# EAGLE design wiPOWER (EAGLE 9.6.1)
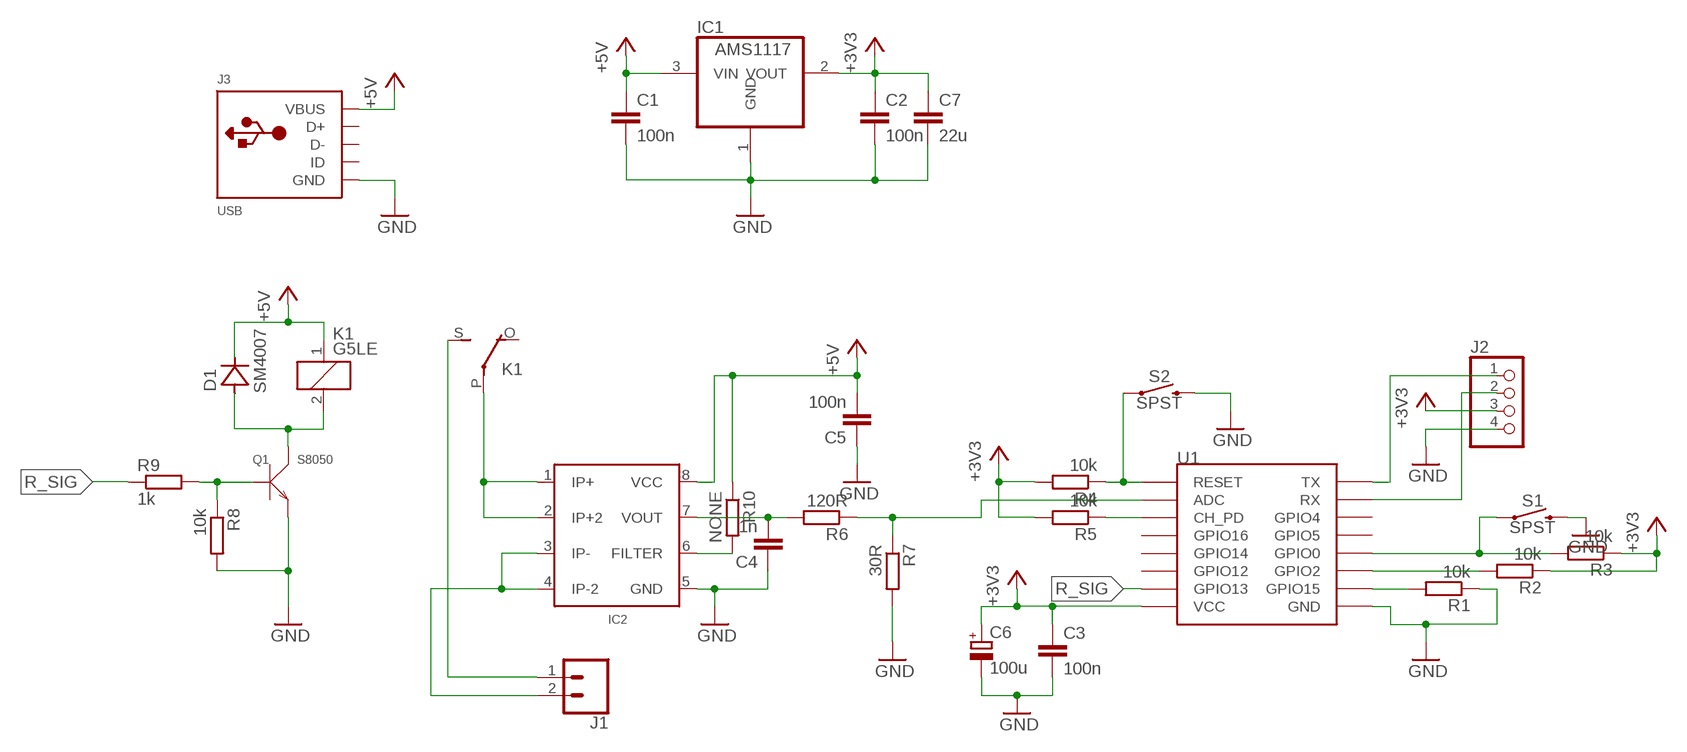
[diagram p0: schematic, sheet 1]

## Parts
C1  100n  C-EUC0603  [C0603]
C2  100n  C-EUC0603  [C0603]
C3  100n  C-EUC0603  [C0603]
C4  1n  C-EUC0603  [C0603]
C5  100n  C-EUC0603  [C0603]
C6  100u  CPOL-EUB/3528-21R  [B/3528-21R]
C7  22u  C-EUC0603  [C0603]
D1  SM4007  SM4007PL  [DIODE_SOD123]
IC1  AMS1117  REG1117  [SOT223]
IC2  ACS712SOIC8  [SOIC8]
J1  CONN_025MM  [SCREWTERMINAL-5MM-2]
J2  PINHD-1X4  [1X04]
J3  USB  USB-MICRO  [MIC-USB]
K1  G5LE  [G5LE]
Q1  S8050  SMD-TRANSISTORS-NPN-25V-500MW-S8050(SOT-23)  [SOT-23]
R1  10k  R-EU_R0603  [R0603]
R2  10k  R-EU_R0603  [R0603]
R3  10k  R-EU_R0603  [R0603]
R4  10k  R-EU_R0603  [R0603]
R5  10k  R-EU_R0603  [R0603]
R6  120R  R-EU_R0603  [R0603]
R7  30R  R-EU_R0603  [R0603]
R8  10k  R-EU_R0603  [R0603]
R9  1k  R-EU_R0603  [R0603]
R10  NONE  R-EU_R0603  [R0603]
S1  SPST  MOMENTARY-SWITCH-SPST-SMD-6.0X3.5MM  [TACTILE_SWITCH_SMD_6.0X3.5MM]
S2  SPST  MOMENTARY-SWITCH-SPST-SMD-6.0X3.5MM  [TACTILE_SWITCH_SMD_6.0X3.5MM]
U1  ESP12SMD  [ESP12-SMD]

## Nets
+3V3 [power]: C2.1 C3.1 C6.+ C7.1 IC1.2(VOUT) J2.3 R2.1 R3.1 R4.2 R5.2 U1.VCC
+5V: C1.1 C5.2 D1.C IC1.3(VIN) IC2.8(VCC) J3.P$5(VBUS) K1.1 R10.1
GND [power]: C1.2 C2.2 C3.2 C4.1 C5.1 C6.- C7.2 IC1.1(GND) IC2.5(GND) J2.4 J3.P$2(GND) Q1.2(E) R1.1 R7.2 R8.2 S1.2 S2.2 U1.GND
IP+ [high]: IC2.1(IP+) IC2.2(IP+2) K1.P(2:P)
IP- [high]: IC2.3(IP-) IC2.4(IP-2) J1.2
N$1: J2.1 U1.TXD0(TX)
N$2: J2.2 U1.RXD0(RX)
N$3: IC2.6(FILTER) R10.2
N$4: R4.1 S2.1 U1.RESET
N$5 [sig]: C4.2 IC2.7(VOUT) R6.2
N$6 [sig]: R6.1 R7.1 U1.ADC
N$7: R5.1 U1.CH_PD
N$10: R1.2 U1.GPIO15
N$11: R2.2 U1.GPIO2
N$12: R3.2 S1.1 U1.GPIO0
N$14: D1.A K1.2 Q1.3(C)
N$15: Q1.1(B) R8.1 R9.2
PRE_IP+ [high]: J1.1 K1.S(2:S)
R_SIG: R9.1 U1.GPIO13
Unconnected: J3.P$1(ID) J3.P$3(D+) J3.P$4(D-) K1.O(2:O) U1.GPIO4 U1.GPIO5 U1.GPIO12 U1.GPIO14 U1.GPIO16

## Library data of the parts
C1-C5 C7 = rcl:C-EU: CAPACITOR, European symbol; SPICEPREFIX: C
C6 = rcl:CPOL-EU: POLARIZED CAPACITOR, European symbol; SPICEPREFIX: C
D1 = mylib:SM4007PL
IC1 = burr-brown:REG1117: 800mA and 1A Low Dropout (LDO) Positive Regulator 1.8V, 2.5V, 2.85V, 3.3V, 5V, and Adj; MPN: REG1117; OC_FARNELL: 1097566; OC_NEWARK: 14P6981
IC2 = mylib:ACS712
J1 = SparkFun-Connectors:CONN_02: Multi connection point. Often used as Generic Header-pin footprint for 0.1 inch spaced/style header connections On any of the 0.1 inch spaced packages, you can populate with these: Break Away Headers - Straight <https://www.sparkfun.com/products/116> (PRT-00116) Break Away Male Headers - Right Angle <https://www.sparkfun.com/products/553> (PRT-00553) Female Headers <https://www.sparkfun.com/products/115> (PRT-00115) Break Away Headers - Machine Pin <https://www.sparkfun.com/products/117> (PRT-00117) Break Away Female Headers - Swiss Machine Pin <https://www.sparkfun.com/products/743> (PRT-00743) For SCREWTERMINALS and SPRING TERMINALS visit here: Screw Terimnals on SparkFun.com <https://www.sparkfun.com/search/results?term=Screw+Terminals> (5mm/3.5mm/2.54mm spacing) This device is also useful as a general connection point to wire up your design to another part of your project. Our various solder wires solder well into these plated through hole pads. Hook-Up Wire - Assortment (Stranded, 22 AWG) <https://www.sparkfun.com/products/11375> (PRT-11375) Hook-Up Wire - Assortment (Solid Core, 22 AWG) <https://www.sparkfun.com/products/11367> (PRT-11367) View the entire wire category on our website here <https://www.sparkfun.com/categories/141> Special notes: Molex polarized connector foot print use with: PRT-08233 with associated crimp pins and housings. 2.54_SCREWTERM for use with PRT-10571. 3.5mm Screw Terminal footprints for PRT-08084 5mm Screw Terminal footprints for use with PRT-08432; SF_SKU: PRT-08432
J2 = pinhead:PINHD-1X4: PIN HEADER
J3 = mylib:USB-MICRO
K1 = relay:G5LE: RELAY 1 x switch, 10 A/120 V AC, 8 A/30 V DC, Omron; OC_FARNELL: unknown; OC_NEWARK: unknown
Q1 = OPL_Discrete_Semiconductor:SMD-TRANSISTORS-NPN-25V-500MW-S8050(SOT-23): 305010017; MPN: S8050
R1-R10 = rcl:R-EU_: RESISTOR, European symbol; SPICEPREFIX: R
S1 S2 = SparkFun-Switches:MOMENTARY-SWITCH-SPST: Momentary Switch (Pushbutton) - SPST Normally-open (NO) SPST momentary switches (buttons, pushbuttons). Variants PTH-12MM - 12mm square, through-hole Momentary Pushbutton Switch - 12mm Square <https://www.sparkfun.com/products/9190> (COM-09190) PTH-6.0MM, PTH-6.0MM-KIT - 6.0mm square, through-hole Mini Pushbutton Switch <https://www.sparkfun.com/products/97> (COM-00097) KIT package intended for soldering kit's - only one side of pads' copper is exposed. PTH-RIGHT-ANGLE-KIT - Right-angle, through-hole Right Angle Tactile Button <https://www.sparkfun.com/products/10791> - Used on SparkFun BigTime Watch Kit <https://www.sparkfun.com/products/11734> SMD-12MM - 12mm square, surface-mount Tactile Button - SMD (12mm) <https://www.sparkfun.com/products/12993> (COM-12993) Used on SparkFun PicoBoard <https://www.sparkfun.com/products/11888> SMD-4.5MM - 4.5mm Square Trackball Switch Used on SparkFun Blackberry Trackballer Breakout <https://www.sparkfun.com/products/13169> SMD-4.6MMX2.8MM - 4.60mm x 2.80mm, surface mount Used on SparkFun SAMD21 Mini Breakout <https://www.sparkfun.com/products/13664> SMD-5.2MM, SMD-5.2-REDUNDANT - 5.2mm square, surface-mount Mini Pushbutton Switch - SMD <https://www.sparkfun.com/products/8720> (COM-08720) Used on Arduino Pro Mini <https://www.sparkfun.com/products/11114> REDUNDANT package connects both switch circuits together SMD-6.0X3.5MM - 6.0 x 3.5mm, surface mount Momentary Reset Switch SMD <https://www.sparkfun.com/products/8229> (COM-08229) SMD-6.2MM-TALL - 6.2mm square, surface mount Tactile Button - SMD (6mm) <https://www.sparkfun.com/products/12992> Used on SparkFun Digital Sandbox <https://www.sparkfun.com/products/12651> SMD-RIGHT-ANGLE - Right-angle, surface mount Used on SparkFun Block for Intel® Edison - Arduino <https://www.sparkfun.com/products/13036>; PROD_ID: SWCH-00815; SF_SKU: COM-08229
U1 = esp8266modules:ESP12: ESP8266 Wifi module 12

## Net classes
0 default: width 0.203 mm
1 power: width 0.305 mm
2 high: width 2.54 mm, clearance 0.762 mm
3 sig: clearance 0.508 mm

## Board
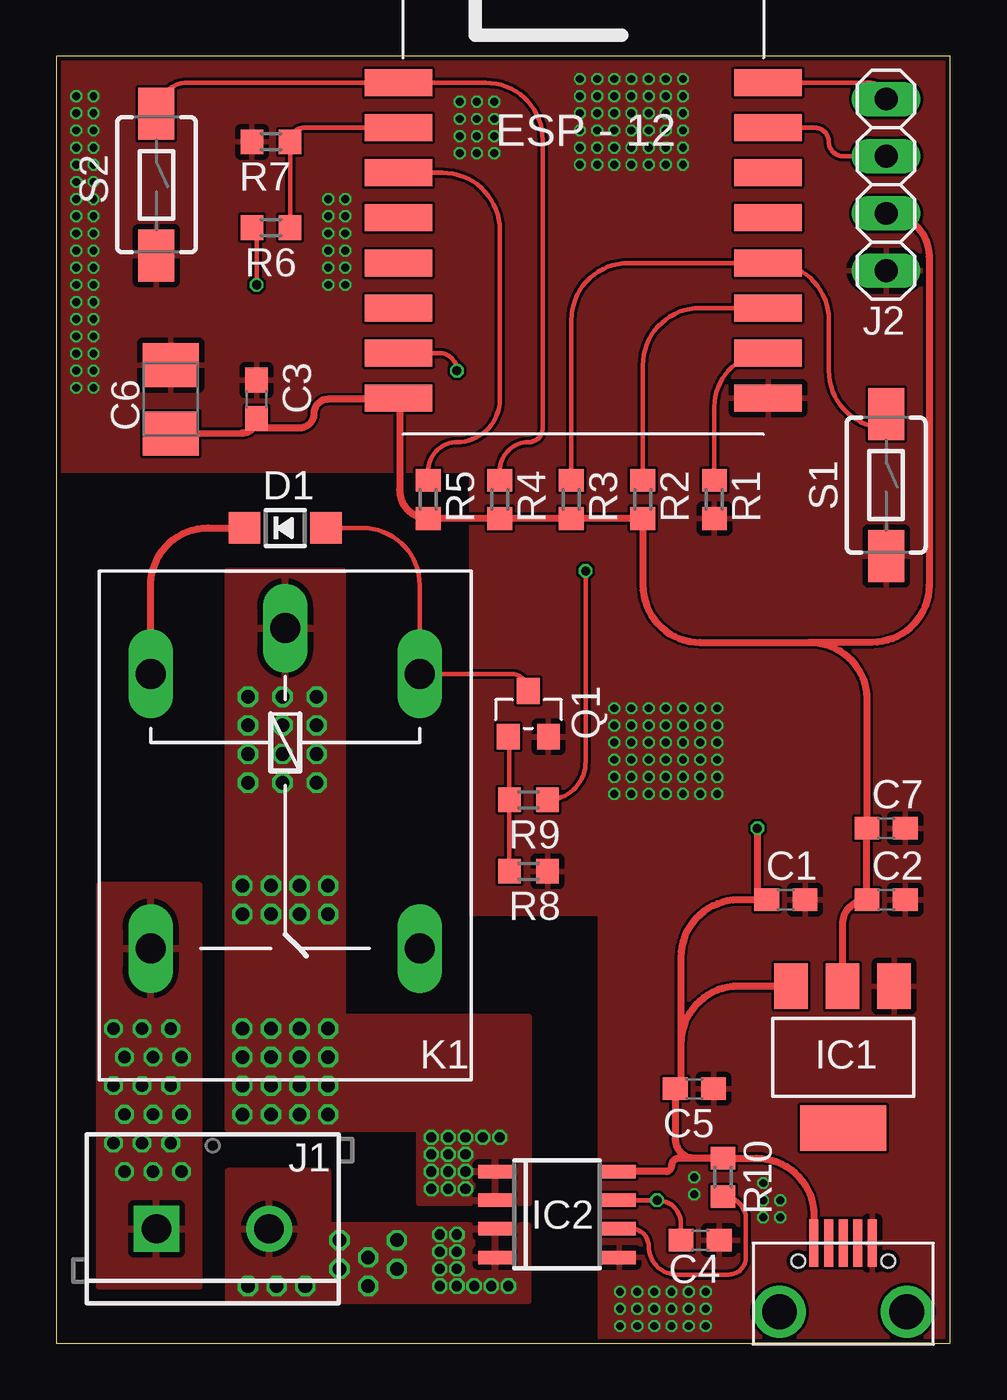
[diagram p1: board, top side]
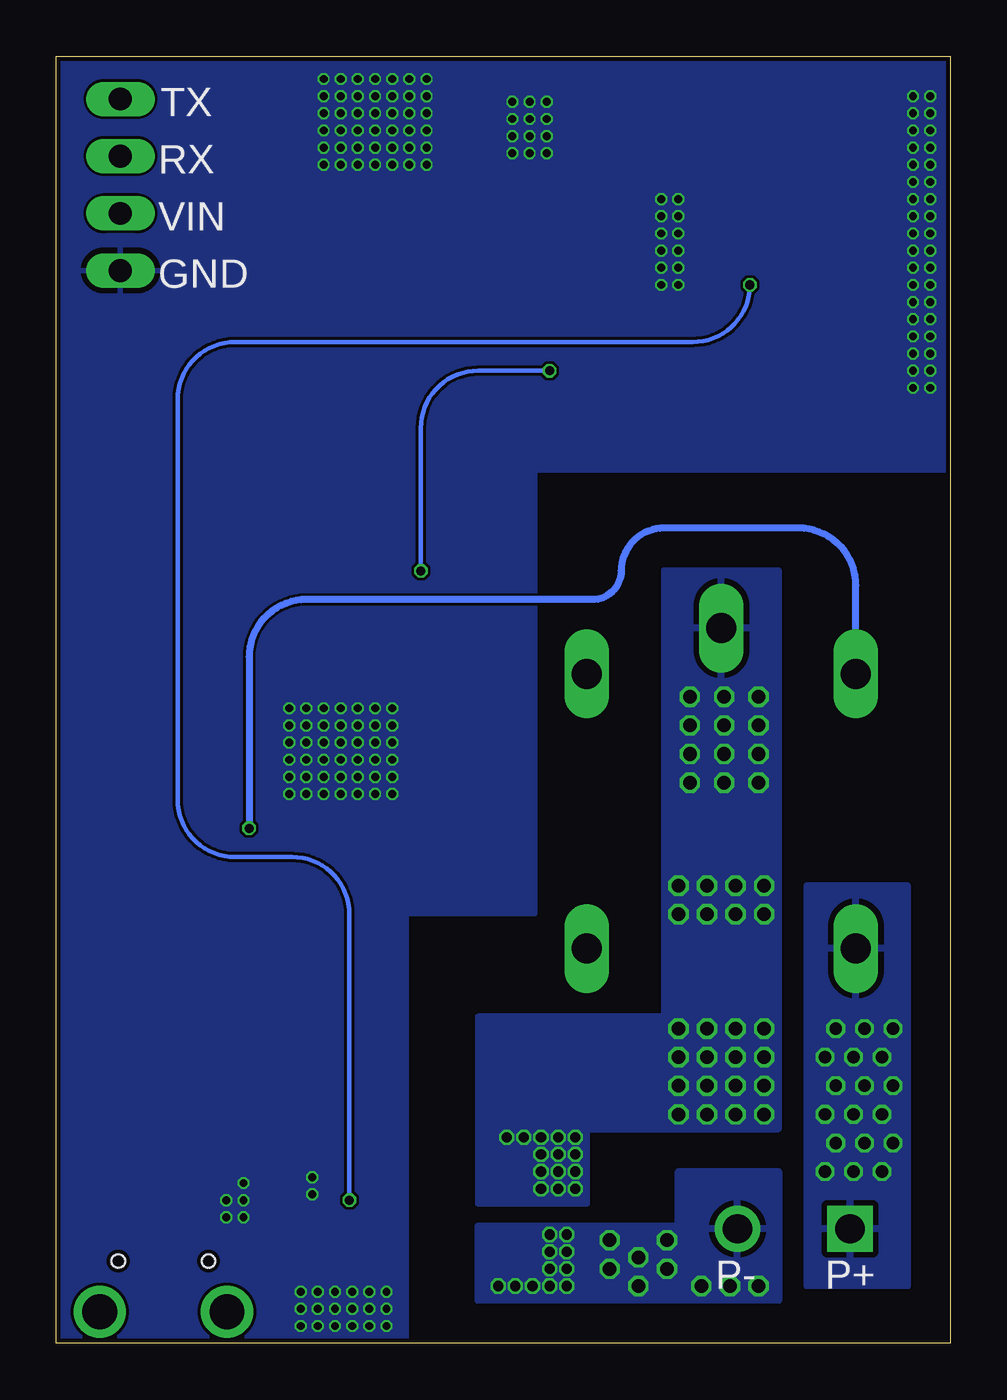
[diagram p2: board, bottom side, seen from below]

Size 39.67 x 57.14 mm. Coordinates in mm from the lower left corner, seen from the top.
Outline: 0,0 39.67,0 39.67,57.14 0,57.14 0,0
Copper layers (1*16): Top 0.035559375mm / dielectric 1.6mm / Bottom 0.035559375mm
Design rules "jlcpcb2layer": minimum track width 5mil, minimum drill 12mil, track to track 5mil, track to pad 5mil, pad to pad 5mil, via to via 5mil, smd to smd 5mil, copper to edge 8mil, drill to drill 6mil, minimum pad ring 5mil, minimum via ring 3mil, stop-mask expansion 2.5mil, vias tented up to drill 0mil, thermal gap 10mil

### Footprints (pad centres in the part's own frame; a part is rotated, then mirrored left to right if it is on the bottom)
C0603 = smd 1.1 x 1: 1 -0.85,0; 2 0.85,0
B/3528-21R = smd 1.95 x 2.5: + 1.525,0; - -1.525,0
DIODE_SOD123 = smd 1.4 x 1.4: A 1.805,0; C -1.805,0
SOT223 = smd 1.499 x 2.007: 1 -2.261,-3.15; 2 0.025,-3.15; 3 2.311,-3.15 | smd 3.81 x 2.007: 4 0,3.15
SOIC8 = smd 0.6 x 1.5: 1 -1.905,-2.75; 2 -0.635,-2.75; 3 0.635,-2.75; 4 1.905,-2.75; 5 1.905,2.75; 6 0.635,2.75; 7 -0.635,2.75; 8 -1.905,2.75
SCREWTERMINAL-5MM-2 = drill 1.3 pad 2.032 square: 1 0,0 | drill 1.3 pad 2.032: 2 5,0
1X04 = drill 1.016 long: 1 -3.81,0; 2 -1.27,0; 3 1.27,0; 4 3.81,0
MIC-USB = smd 0.4 x 2.1: P$1 -0.65,0; P$2 -1.3,0; P$3 0,0; P$4 0.65,0; P$5 1.3,0 | drill 1.55: P$6 -2.825,3.05; P$7 2.825,3.05 | hole 0.6: -2,0.8; 2,0.8
G5LE = drill 1.321 long: 1 -7.493,-5.969; 2 -7.493,5.969; O 4.699,5.969; P -9.525,0; S 4.699,-5.969
SOT-23 = smd 1.016 x 1.143: 1 -0.889,-1.016; 2 0.889,-1.016; 3 0,1.016
R0603 = smd 1 x 1.1: 1 -0.85,0; 2 0.85,0
TACTILE_SWITCH_SMD_6.0X3.5MM = smd 2.3 x 1.6: 1 -3.15,0; 2 3.15,0
ESP12-SMD = smd 3 x 1.2: ADC -8.3,3.8; CH_PD -8.3,1.8; GND 8.1,-8.2; GPIO0 8.1,-2.2; GPIO2 8.1,-4.2; GPIO4 8.1,1.8; GPIO5 8.1,-0.2; GPIO12 -8.3,-4.2; GPIO13 -8.3,-6.2; GPIO14 -8.3,-2.2; GPIO15 8.1,-6.2; GPIO16 -8.3,-0.2; RESET -8.3,5.8; RXD0 8.1,3.8; TXD0 8.1,5.8; VCC -8.3,-8.2

### Placement (x,y rotation side)
C1  32.38,19.68 0 top
C2  36.83,19.68 0 top
C3  8.89,41.91 90 top
C4  28.57,4.57 180 top
C5  28.32,11.3 180 top
C6  5.08,41.91 270 top
C7  36.83,22.86 0 top
D1  10.16,36.2 0 top
IC1  34.92,12.7 180 top
IC2  22.22,5.71 270 top
J1  4.44,5.08 0 top
J2  36.83,51.44 270 top
J3  34.92,4.45 180 top
K1  10.16,22.23 270 top
Q1  20.95,27.94 0 top
R1  29.21,37.47 90 top
R2  26.04,37.47 90 top
R3  22.86,37.47 90 top
R4  19.68,37.47 270 top
R5  16.51,37.47 270 top
R6  9.53,49.53 180 top
R7  9.53,53.34 180 top
R8  20.95,20.95 0 top
R9  20.95,24.13 180 top
R10  29.59,7.37 270 top
S1  36.83,38.1 270 top
S2  4.44,51.44 270 top
U1  23.49,50.16 0 top

### Tracks (layer width: path | path; a pad name or v marks a point on that pad's centre or on a via)
+3V3
  Top 0.305: IC1.2 34.9,18.61 arc-90 C2.1 C7.1 35.98,28.57 arc90 33.44,31.11 | 33.44,31.11 28.57,31.11 arc-90 26.04,33.66 R2.1 R3.1 R4.2 R5.2 arc-90 15.24,37.88 15.24,41.92 arc90 U1.VCC arc-90 15.14,41.91 12.07,41.91 arc90 11.43,41.27 arc-90 10.79,40.64 8.89,40.64 C3.1 arc-90 8.24,40.41 C6.+ | J2.3 arc-90 38.73,48.26 38.73,33.66 arc-90 36.2,31.11 33.44,31.11
+5V  (via drill 0.4)
  Top 0.305: IC1.3 30.27,15.85 arc90 27.72,13.31 | 27.72,13.31 27.72,17.14 arc-90 30.27,19.68 C1.1 arc-90 31.12,20.11 v31.12,22.86 | K1.1 4.19,33.66 arc-90 6.73,36.2 D1.C | 27.72,11.56 arc-90 C5.2 | 27.72,13.31 27.72,11.56 | 27.72,11.56 arc-90 C5.2 | 28.32,8.22 27.65,8.22 arc90 27.3,7.87 arc-90 27.05,7.62 IC2.8 | C5.2 27.47,9.07 arc90 28.32,8.22 | J3.P$5 33.62,5.68 arc90 31.09,8.22 R10.1 28.32,8.22
  Bottom 0.305: K1.1 4.19,33.66 arc-90 6.73,36.2 12.7,36.2 arc-90 14.61,34.29 arc90 15.88,33.02 28.57,33.02 arc-90 31.12,30.48 v31.12,22.86
GND  (via drill 0.35)
  other vias: 25.78,1.52 26.54,1.52 27.3,1.52 28.07,1.52 28.83,1.52 28.83,2.29 28.07,2.29 27.3,2.29 26.54,2.29 25.78,2.29 25.78,0.76 26.54,0.76 27.3,0.76 28.07,0.76 28.83,0.76 25.02,2.29 25.02,1.52 25.02,0.76 17.91,55.12 17.91,54.36 17.91,53.59 17.91,52.83 18.67,52.83 19.43,52.83 18.67,53.59 19.43,53.59 19.43,54.36 19.43,55.12 18.67,55.12 18.67,54.36 23.24,56.13 24,56.13 24.77,56.13 25.53,56.13 26.29,56.13 27.05,56.13 23.24,54.61 24,54.61 24.77,54.61 25.53,54.61 26.29,54.61 27.05,54.61 23.24,55.37 24,55.37 24.77,55.37 25.53,55.37 26.29,55.37 27.05,55.37 23.24,53.85 24,53.85 24.77,53.85 25.53,53.85 26.29,53.85 27.05,53.85 23.24,53.09 24,53.09 24.77,53.09 25.53,53.09 26.29,53.09 27.05,53.09 23.24,52.32 24,52.32 24.77,52.32 25.53,52.32 26.29,52.32 27.05,52.32 27.81,52.32 27.81,53.09 27.81,53.85 27.81,54.61 27.81,55.37 27.81,56.13 0.89,46.23 1.65,46.23 0.89,44.7 1.65,44.7 0.89,45.47 1.65,45.47 0.89,43.94 1.65,43.94 0.89,43.18 1.65,43.18 0.89,42.42 1.65,42.42 0.89,50.8 1.65,50.8 0.89,49.28 1.65,49.28 0.89,50.04 1.65,50.04 0.89,48.51 1.65,48.51 0.89,47.75 1.65,47.75 0.89,46.99 1.65,46.99 0.89,55.37 1.65,55.37 0.89,53.85 1.65,53.85 0.89,54.61 1.65,54.61 0.89,53.09 1.65,53.09 0.89,52.32 1.65,52.32 0.89,51.56 1.65,51.56 12.07,50.8 12.83,50.8 12.07,49.28 12.83,49.28 12.07,50.04 12.83,50.04 12.07,48.51 12.83,48.51 12.07,47.75 12.83,47.75 12.07,46.99 12.83,46.99 24.77,28.19 25.53,28.19 26.29,28.19 27.05,28.19 27.81,28.19 28.57,28.19 24.77,26.67 25.53,26.67 26.29,26.67 27.05,26.67 27.81,26.67 28.57,26.67 24.77,27.43 25.53,27.43 26.29,27.43 27.05,27.43 27.81,27.43 28.57,27.43 24.77,25.91 25.53,25.91 26.29,25.91 27.05,25.91 27.81,25.91 28.57,25.91 24.77,25.15 25.53,25.15 26.29,25.15 27.05,25.15 27.81,25.15 28.57,25.15 24.77,24.38 25.53,24.38 26.29,24.38 27.05,24.38 27.81,24.38 28.57,24.38 29.34,24.38 29.34,25.15 29.34,25.91 29.34,26.67 29.34,27.43 29.34,28.19 28.32,7.37 28.32,6.6 31.37,7.11 31.37,6.35 31.37,5.59 32.13,5.59 32.13,6.35
  pour Top: 0,38.73 18.41,38.73 18.41,19.05 24.13,19.05 24.13,2.54 24.13,0 40,0 40,57.15 0,57.15
  pour Bottom: 0,38.73 18.41,38.73 18.41,19.05 24.13,19.05 24.13,2.54 24.13,0 40,0 40,57.15 0,57.15
IP+  (via drill 0.45, 0.6)
  other vias: 16.64,6.86 17.4,6.86 17.4,7.62 9.53,12.7 9.53,11.43 10.79,12.7 9.53,20.32 8.26,20.32 10.79,20.32 12.07,20.32 8.26,19.05 9.53,19.05 10.79,19.05 12.07,19.05 8.26,13.97 9.53,13.97 10.79,13.97 12.07,13.97 12.07,12.7 8.26,12.7 8.26,11.43 10.79,11.43 12.07,11.43 12.07,10.16 10.79,10.16 9.53,10.16 8.26,10.16 8.51,24.89 8.51,26.16 8.51,27.43 8.51,28.7 11.56,28.7 11.56,27.43 11.56,26.16 11.56,24.89 10.03,24.89 10.03,26.16 10.03,27.43 10.03,28.7 16.64,9.14 17.4,9.14 18.16,9.14 18.92,9.14 19.68,9.14 18.16,8.38 18.16,6.86 18.16,7.62 16.64,7.62 16.64,8.38 17.4,8.38
  pour Top: 20.95,6.22 16.13,6.22 16.13,9.53 7.62,9.53 7.62,34.29 12.7,34.29 12.7,14.48 20.95,14.48
  pour Bottom: 20.95,6.22 16.13,6.22 16.13,9.53 7.62,9.53 7.62,34.29 12.7,34.29 12.7,14.48 20.95,14.48
IP-  (via drill 0.45, 0.6)
  other vias: 17.78,4.83 17.78,4.06 17.78,3.3 17.78,2.54 18.54,2.54 19.3,2.54 20.07,2.54 17.02,4.83 17.02,4.06 17.02,3.3 17.02,2.54 15.11,4.57 15.11,3.3 13.84,2.54 13.84,3.81 12.57,3.3 12.57,4.57 11.05,2.54 9.78,2.54 8.51,2.54
  pour Top: 7.62,7.62 7.62,1.91 20.95,1.91 20.95,5.21 12.07,5.21 12.07,7.62
  pour Bottom: 7.62,7.62 7.62,1.91 20.95,1.91 20.95,5.21 12.07,5.21 12.07,7.62
N$1
  Top 0.203: U1.TXD0 36.11,55.97 arc-90 J2.1
N$2
  Top 0.203: U1.RXD0 33.66,53.97 arc-90 34.29,53.34 arc90 34.92,52.7 J2.2
N$3
  Top 0.203: IC2.6 25.53,5.08 arc-90 26.29,4.32 arc90 27.56,3.05 29.84,3.05 arc90 30.61,3.81 30.61,5.5 arc90 R10.2
N$4
  Top 0.203: S2.1 arc-90 5.83,55.97 U1.RESET 19.05,55.97 arc-90 21.59,53.42 21.59,40.64 arc-90 20.95,40.01 arc90 19.68,38.73 R4.1
N$5  (via drill 0.4)
  Top 0.203: IC2.7 v26.67,6.35 arc-90 27.72,5.29 C4.2 | v8.89,46.99 8.89,49.31 arc90 R6.2
  Bottom 0.203: v26.67,6.35 26.67,19.05 arc-90 29.21,21.59 31.75,21.59 arc90 34.29,24.13 34.29,41.91 arc90 31.75,44.45 11.43,44.45 arc-90 v8.89,46.99
N$6
  Top 0.203: U1.ADC 11,53.97 arc90 R7.1 R6.1
N$7
  Top 0.203: R5.1 16.51,38.73 arc-90 17.78,40.01 arc90 19.68,41.91 19.68,49.42 arc90 17.14,51.97 U1.CH_PD
N$10
  Top 0.203: U1.GPIO15 arc90 29.21,41.58 R1.2
N$11
  Top 0.203: R2.2 26.04,43.42 arc-90 28.57,45.97 U1.GPIO2
N$12
  Top 0.203: R3.2 22.86,45.42 arc-90 25.4,47.97 U1.GPIO0 31.75,47.97 arc-90 34.29,45.42 34.29,43.18 arc90 36.83,40.64 S1.1
N$14
  Top 0.203: D1.A 13.59,36.2 arc-90 16.13,33.66 K1.2 20.19,29.72 arc-90 Q1.3
N$15
  Top 0.203: Q1.1 arc-90 20.11,26.89 R9.2 R8.1
PRE_IP+  (via drill 0.55)
  other vias: 3.02,7.62 4.29,7.62 5.56,7.62 5.08,8.89 3.81,8.89 2.54,8.89 5.56,10.16 4.29,10.16 3.02,10.16 5.08,11.43 3.81,11.43 2.54,11.43 5.56,12.7 4.29,12.7 3.02,12.7 5.08,13.97 3.81,13.97 2.54,13.97
  pour Top: 1.91,2.54 6.35,2.54 6.35,20.32 1.91,20.32
  pour Bottom: 1.91,2.54 6.35,2.54 6.35,20.32 1.91,20.32
  pour Bottom: 1.91,2.54 6.35,2.54 6.35,20.32 1.91,20.32
  pour Bottom: 1.91,2.54 5.87,2.54 5.87,20.32 1.91,20.32
R_SIG  (via drill 0.4)
  Top 0.203: R9.1 arc90 23.49,25.82 v23.49,34.29 | v17.78,43.18 arc90 16.99,43.97 U1.GPIO13
  Bottom 0.203: v23.49,34.29 23.49,40.64 arc90 20.95,43.18 v17.78,43.18

### Text on the board
bNames: TX | RX | VIN | GND | P+ | P-